# EAGLE design saklar not sentuhan (EAGLE 9.6.2)
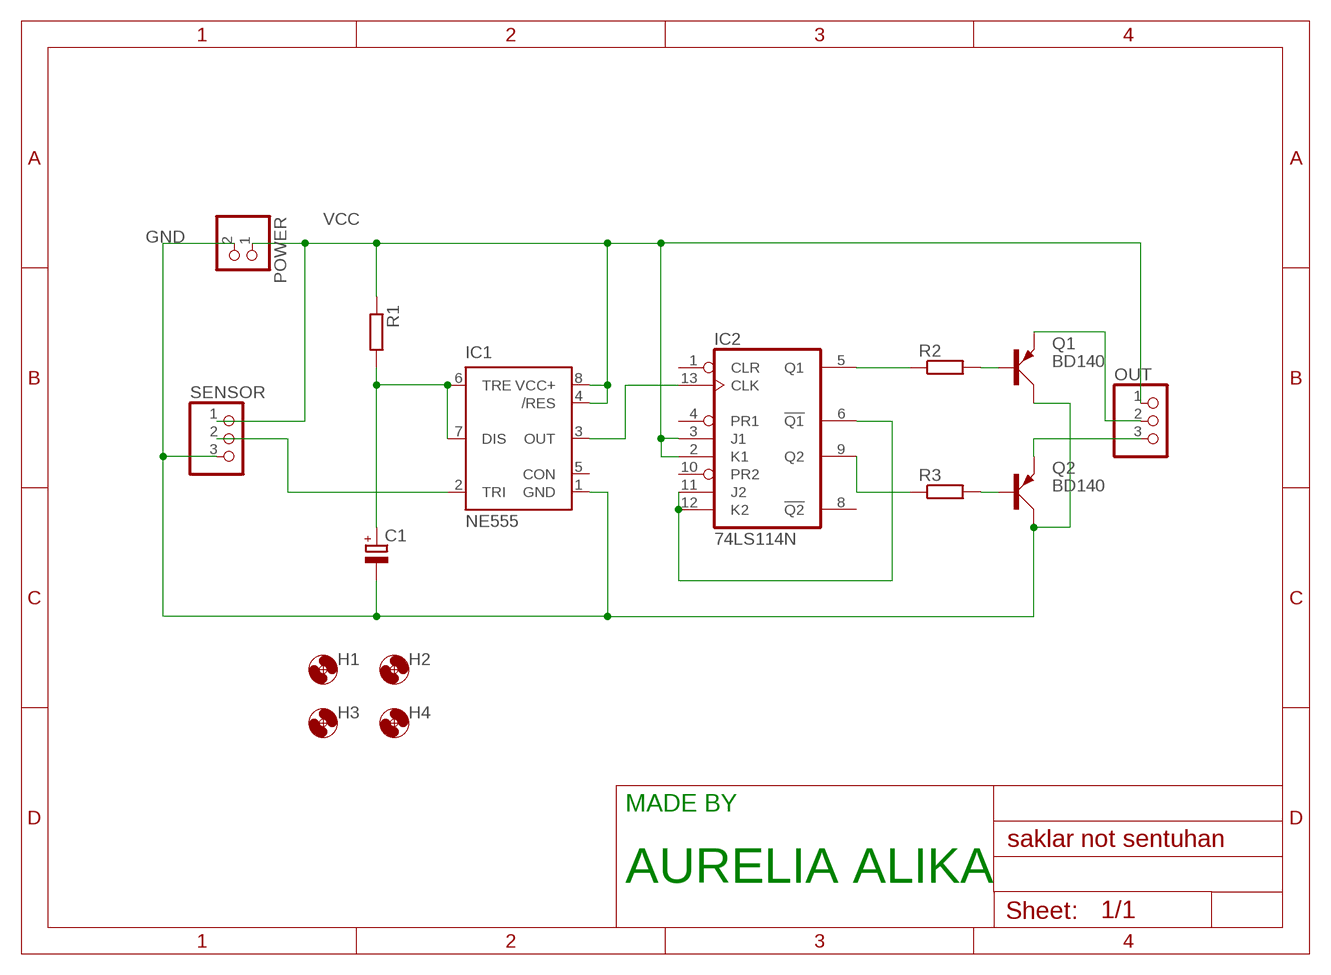
[diagram p0: schematic, sheet 1]

## Parts
C1  CPOL-EUE2,5-6E  [E2,5-6E]
H1  MOUNT-HOLE3.6  [3,6]
H2  MOUNT-HOLE3.6  [3,6]
H3  MOUNT-HOLE3.6  [3,6]
H4  MOUNT-HOLE3.6  [3,6]
IC1  NE555  [DIL-08]
IC2  74LS114N  [DIL14]
OUT  PINHD-1X3  [1X03]
POWER  PINHD-1X2  [1X02]
Q1  BD140  [TO126AV]
Q2  BD140  [TO126AV]
R1  R-EU_0207/15  [0207/15]
R2  R-EU_0207/15  [0207/15]
R3  R-EU_0207/15  [0207/15]
SENSOR  PINHD-1X3  [1X03]

## Nets
GND: C1.- IC1.1(GND) POWER.2 Q1.C Q2.C SENSOR.3
N$1: IC1.3(OUT) IC2.13(CLK)
N$2: OUT.2 Q1.E
N$3: IC2.5(Q1) R2.1
N$4: OUT.3 Q2.E
N$5: C1.+ IC1.6(TRE) IC1.7(DIS) R1.2
N$6: IC1.2(TRI) SENSOR.2
N$7: Q1.B R2.2
N$8: IC2.9(Q2) R3.1
N$9: Q2.B R3.2
N$11: IC2.6(!Q1) IC2.11(J2) IC2.12(K2)
VCC: IC1.4(/RES) IC1.8(VCC+) IC2.2(K1) IC2.3(J1) OUT.1 POWER.1 R1.1 SENSOR.1
Unconnected: IC1.5(CON) IC2.1(CLR) IC2.4(PR1) IC2.8(!Q2) IC2.10(PR2)

## Notes on the sheet
- MADE BY
- AURELIA ALIKA

## Power pins joined to a net without a drawn wire
GND: IC2.7(GND)
VCC: IC2.14(VCC)

## Library data of the parts
C1 = rcl:CPOL-EU: POLARIZED CAPACITOR, European symbol; SPICEPREFIX: C
H1-H4 = holes:MOUNT-HOLE: MOUNTING HOLE with drill center marker
IC1 = st-microelectronics 2:NE555: General purpose bipolar Timer; MF: Arrow Electronics; MPN: NE555N; OC_FARNELL: 1467742; OC_NEWARK: 89K1486
IC2 = 74xx-eu EDIT:74*114: Dual J-K negative edge triggered FLIP FLOP, preset, common clear, clock
OUT SENSOR = pinhead 2:PINHD-1X3: PIN HEADER
POWER = pinhead 2:PINHD-1X2: PIN HEADER
Q1 Q2 = transistor-power 2:BD140: PNP TRANSISTOR
R1-R3 = rcl:R-EU_: RESISTOR, European symbol; SPICEPREFIX: R

## Board
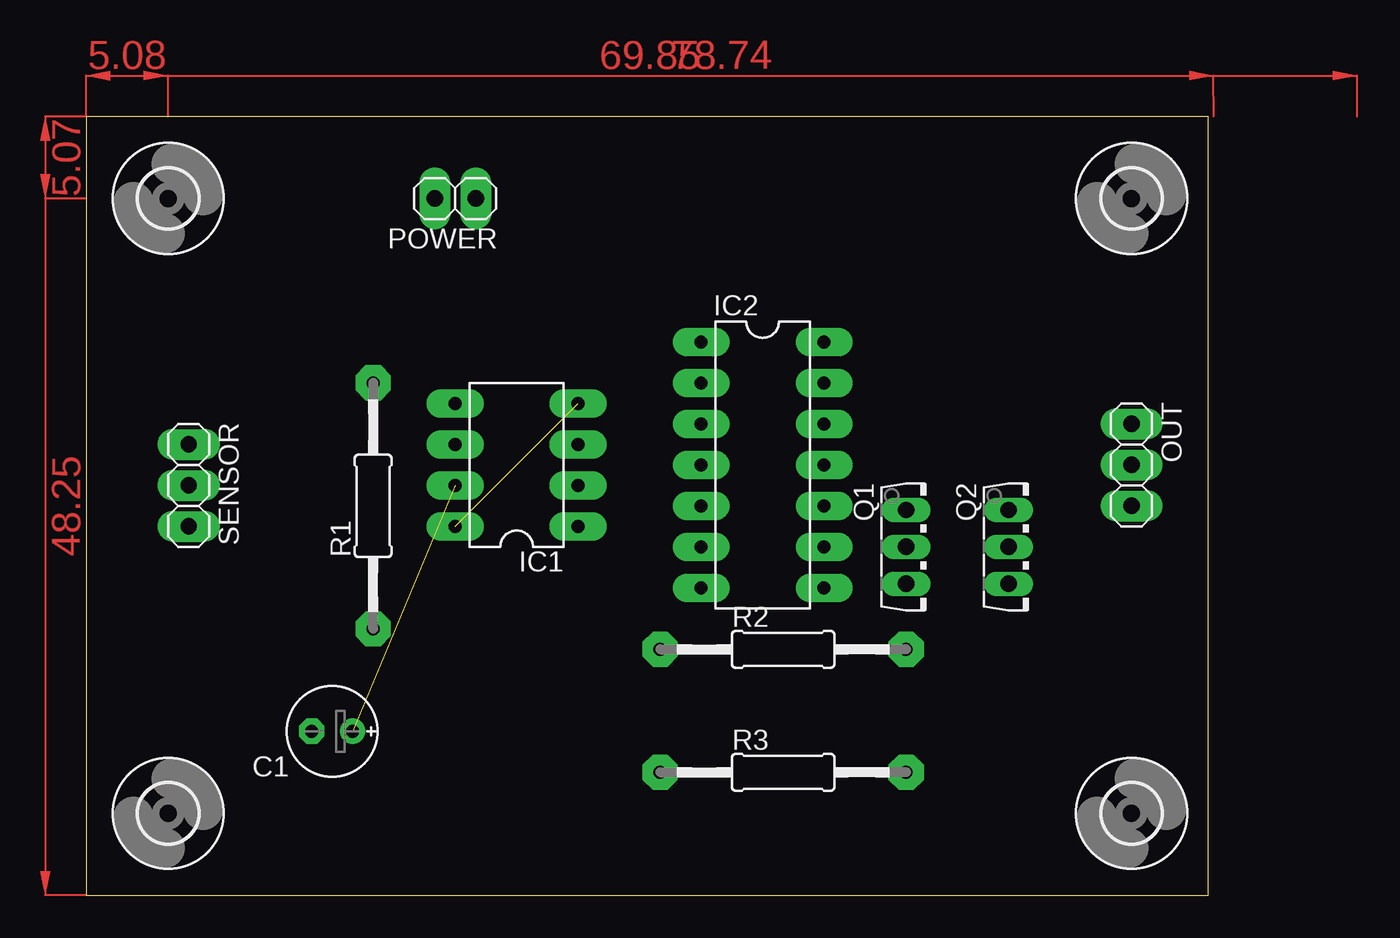
[diagram p1: board, top side]
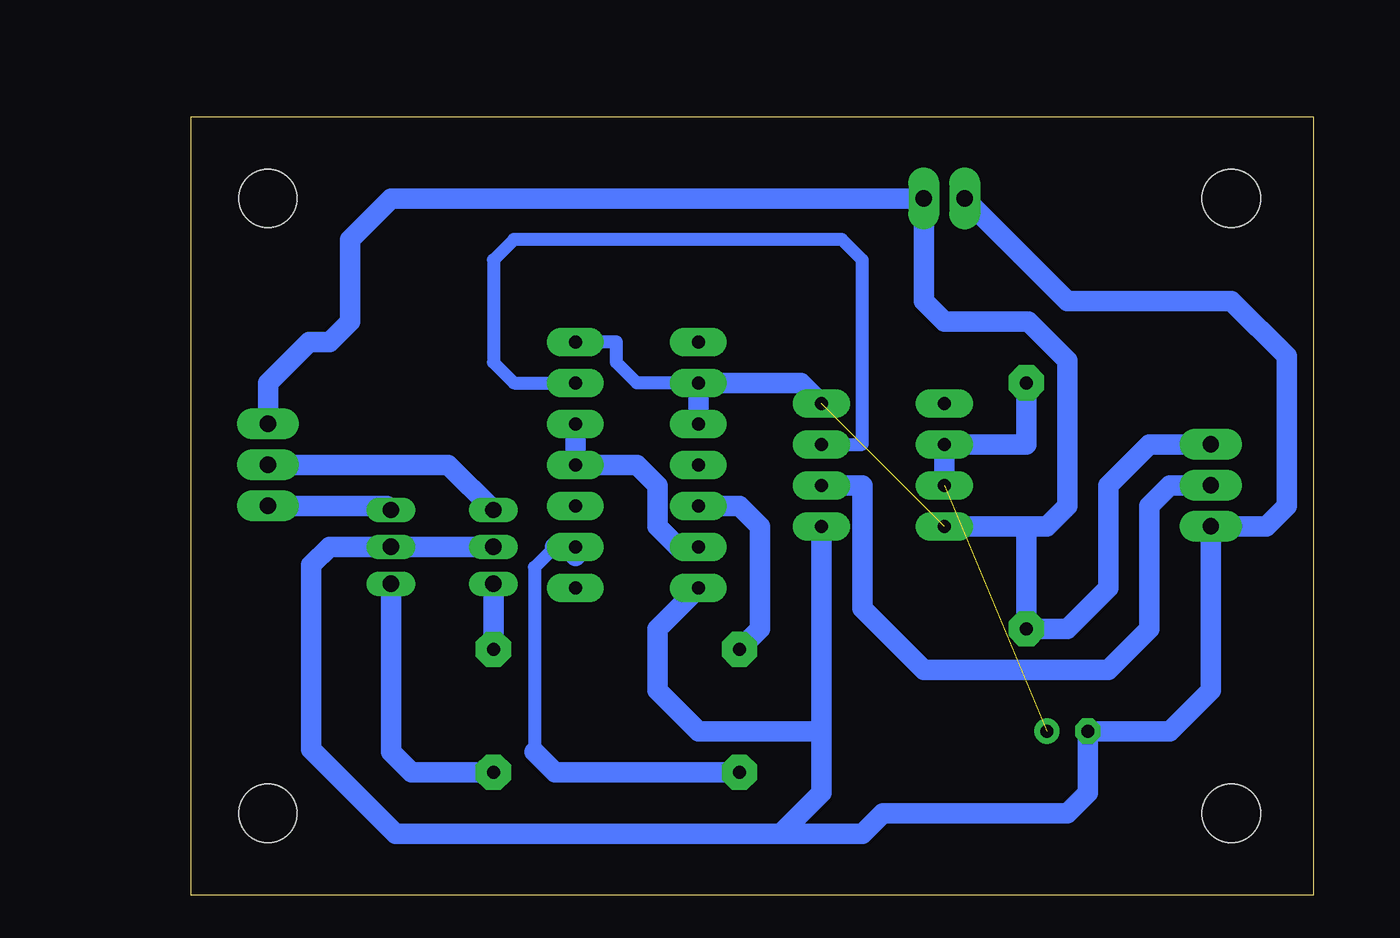
[diagram p2: board, bottom side, seen from below]

Size 69.52 x 48.25 mm. Coordinates in mm from the lower left corner, seen from the top.
Outline: 0,0 69.52,0 69.52,48.25 0,48.25 0,0
Copper layers (1*16): Top 0.035mm / dielectric 1.5mm / Bottom 0.035mm
Design rules "default": minimum track width 6mil, minimum drill 0.35mm, track to track 6mil, track to pad 6mil, pad to pad 6mil, via to via 6mil, smd to smd 6mil, copper to edge 40mil, drill to drill 6mil, minimum pad ring 10mil, minimum via ring 8mil, stop-mask expansion 4mil, vias tented up to drill 0mil, thermal gap 10mil

### Footprints (pad centres in the part's own frame; a part is rotated, then mirrored left to right if it is on the bottom)
E2,5-6E = drill 0.813 pad 1.575: + -1.27,0 | drill 0.813 pad 1.575 octagon: - 1.27,0
3,6 = hole 3.6: 0,0
DIL-08 = drill 0.813 pad 1.778 long: 1 -3.81,-3.81; 2 -1.27,-3.81; 3 1.27,-3.81; 4 3.81,-3.81; 5 3.81,3.81; 6 1.27,3.81; 7 -1.27,3.81; 8 -3.81,3.81
DIL14 = drill 0.813 pad 1.778 long: 1 -7.62,-3.81; 2 -5.08,-3.81; 3 -2.54,-3.81; 4 0,-3.81; 5 2.54,-3.81; 6 5.08,-3.81; 7 7.62,-3.81; 8 7.62,3.81; 9 5.08,3.81; 10 2.54,3.81; 11 0,3.81; 12 -2.54,3.81; 13 -5.08,3.81; 14 -7.62,3.81
1X03 = drill 1.016 pad 1.93 long: 1 -2.54,0; 2 0,0; 3 2.54,0
1X02 = drill 1.016 pad 1.93 long: 1 -1.27,0; 2 1.27,0
TO126AV = drill 1.016 long: B 2.286,-1.27; C 0,-1.27; E -2.286,-1.27
0207/15 = drill 0.813 pad 2.184 octagon: 1 -7.62,0; 2 7.62,0

### Placement (x,y rotation side)
C1  15.24,10.16 180 top
H1  64.77,43.18 0 top
H2  64.77,5.08 0 top
H3  5.08,5.08 0 top
H4  5.08,43.18 0 top
IC1  26.67,26.67 90 top
IC2  41.91,26.67 270 top
OUT  64.77,26.67 270 top
POWER  22.86,43.18 180 top
Q1  52.07,21.59 270 top
Q2  58.42,21.59 270 top
R1  17.78,24.13 90 top
R2  43.18,15.24 0 top
R3  43.18,7.62 0 top
SENSOR  6.35,25.4 270 top

### Tracks (layer width: path | path; a pad name or v marks a point on that pad's centre or on a via)
GND
  Bottom 1.27: POWER.2 15.24,36.83 5.08,36.83 1.65,33.4 1.65,24.13 2.92,22.86 SENSOR.3 6.35,12.7 8.89,10.16 C1.- 13.97,6.35 15.24,5.08 26.67,5.08 27.94,3.81 33.02,3.81 | Q1.C Q2.C 60.96,21.59 62.08,20.47 62.08,9.04 56.85,3.81 33.02,3.81 | IC1.1 30.48,10.16 | 30.48,10.16 30.48,6.35 33.02,3.81 | IC2.7 40.64,16.51 40.64,12.7 38.1,10.16 30.48,10.16
N$1
  Bottom 0.813: IC1.3 27.94,27.94 27.94,39.37 29.21,40.64 49.53,40.64 50.8,39.37 50.8,33.02 49.53,31.75 IC2.13
N$2
  Bottom 1.27: Q1.E 53.59,26.67 OUT.2
N$3
  Bottom 1.27: IC2.5 35.56,24.13 34.29,22.86 34.29,16.51 R2.1
N$4
  Bottom 1.27: OUT.3 57.4,24.13 Q2.E
N$5  (1 unrouted)
  Bottom 1.27: R1.2 17.78,27.94 IC1.6 IC1.7
N$6
  Bottom 1.27: SENSOR.2 8.89,25.4 10.16,24.13 10.16,16.51 12.7,13.97 24.13,13.97 27.94,17.78 27.94,25.4 IC1.2
N$7
  Bottom 1.27: Q1.B R2.2
N$8
  Bottom 0.813: 46.99,21.59 48.26,20.32 48.26,8.89
  Bottom 1.27: 46.99,21.59 IC2.9 45.72,21.04 | 48.26,8.89 46.99,7.62 R3.1
N$9
  Bottom 1.27: R3.2 55.88,7.62 57.15,8.89 Q2.B
N$11
  Bottom 1.27: IC2.6 39.37,21.59 40.64,22.86 40.64,25.4 41.91,26.67 IC2.11 IC2.12
VCC  (1 unrouted)
  Bottom 0.813: IC2.2 41.91,31.75 43.18,33.02 43.18,34.29 IC2.14
  Bottom 1.27: IC2.3 IC2.2 31.75,31.75 IC1.4 | OUT.1 64.77,31.75 62.23,34.29 60.96,34.29 59.69,35.56 59.69,40.64 57.15,43.18 POWER.1 24.13,36.83 22.86,35.56 17.66,35.56 15.24,33.14 15.24,24.13 16.51,22.86 17.78,22.86 | SENSOR.1 10.16,27.94 12.7,25.4 12.7,19.05 15.24,16.51 R1.1 17.78,22.86 | IC1.8 17.78,22.86
(copper drawn outside any net)
  shapes: Top area x5